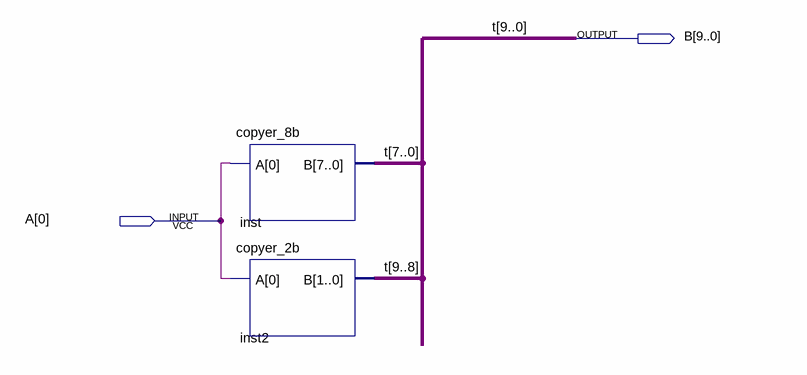
[diagram p0: schematic sheet]
// Quartus schematic copyer_10b.bdf as structural Verilog: 2 symbols, 2 pins
module copyer_10b (
  input  [0:0] A,
  output [9:0] B
);

  copyer_8b inst (.A(A[0]), .B(B[7:0]));
  copyer_2b inst2 (.A(A[0]), .B(B[9:8]));

  // Other names for the same wires on the sheet: t[9:0] = B
endmodule
